# Altium schematic sheet USB3.0.SchDoc: USB
size A3
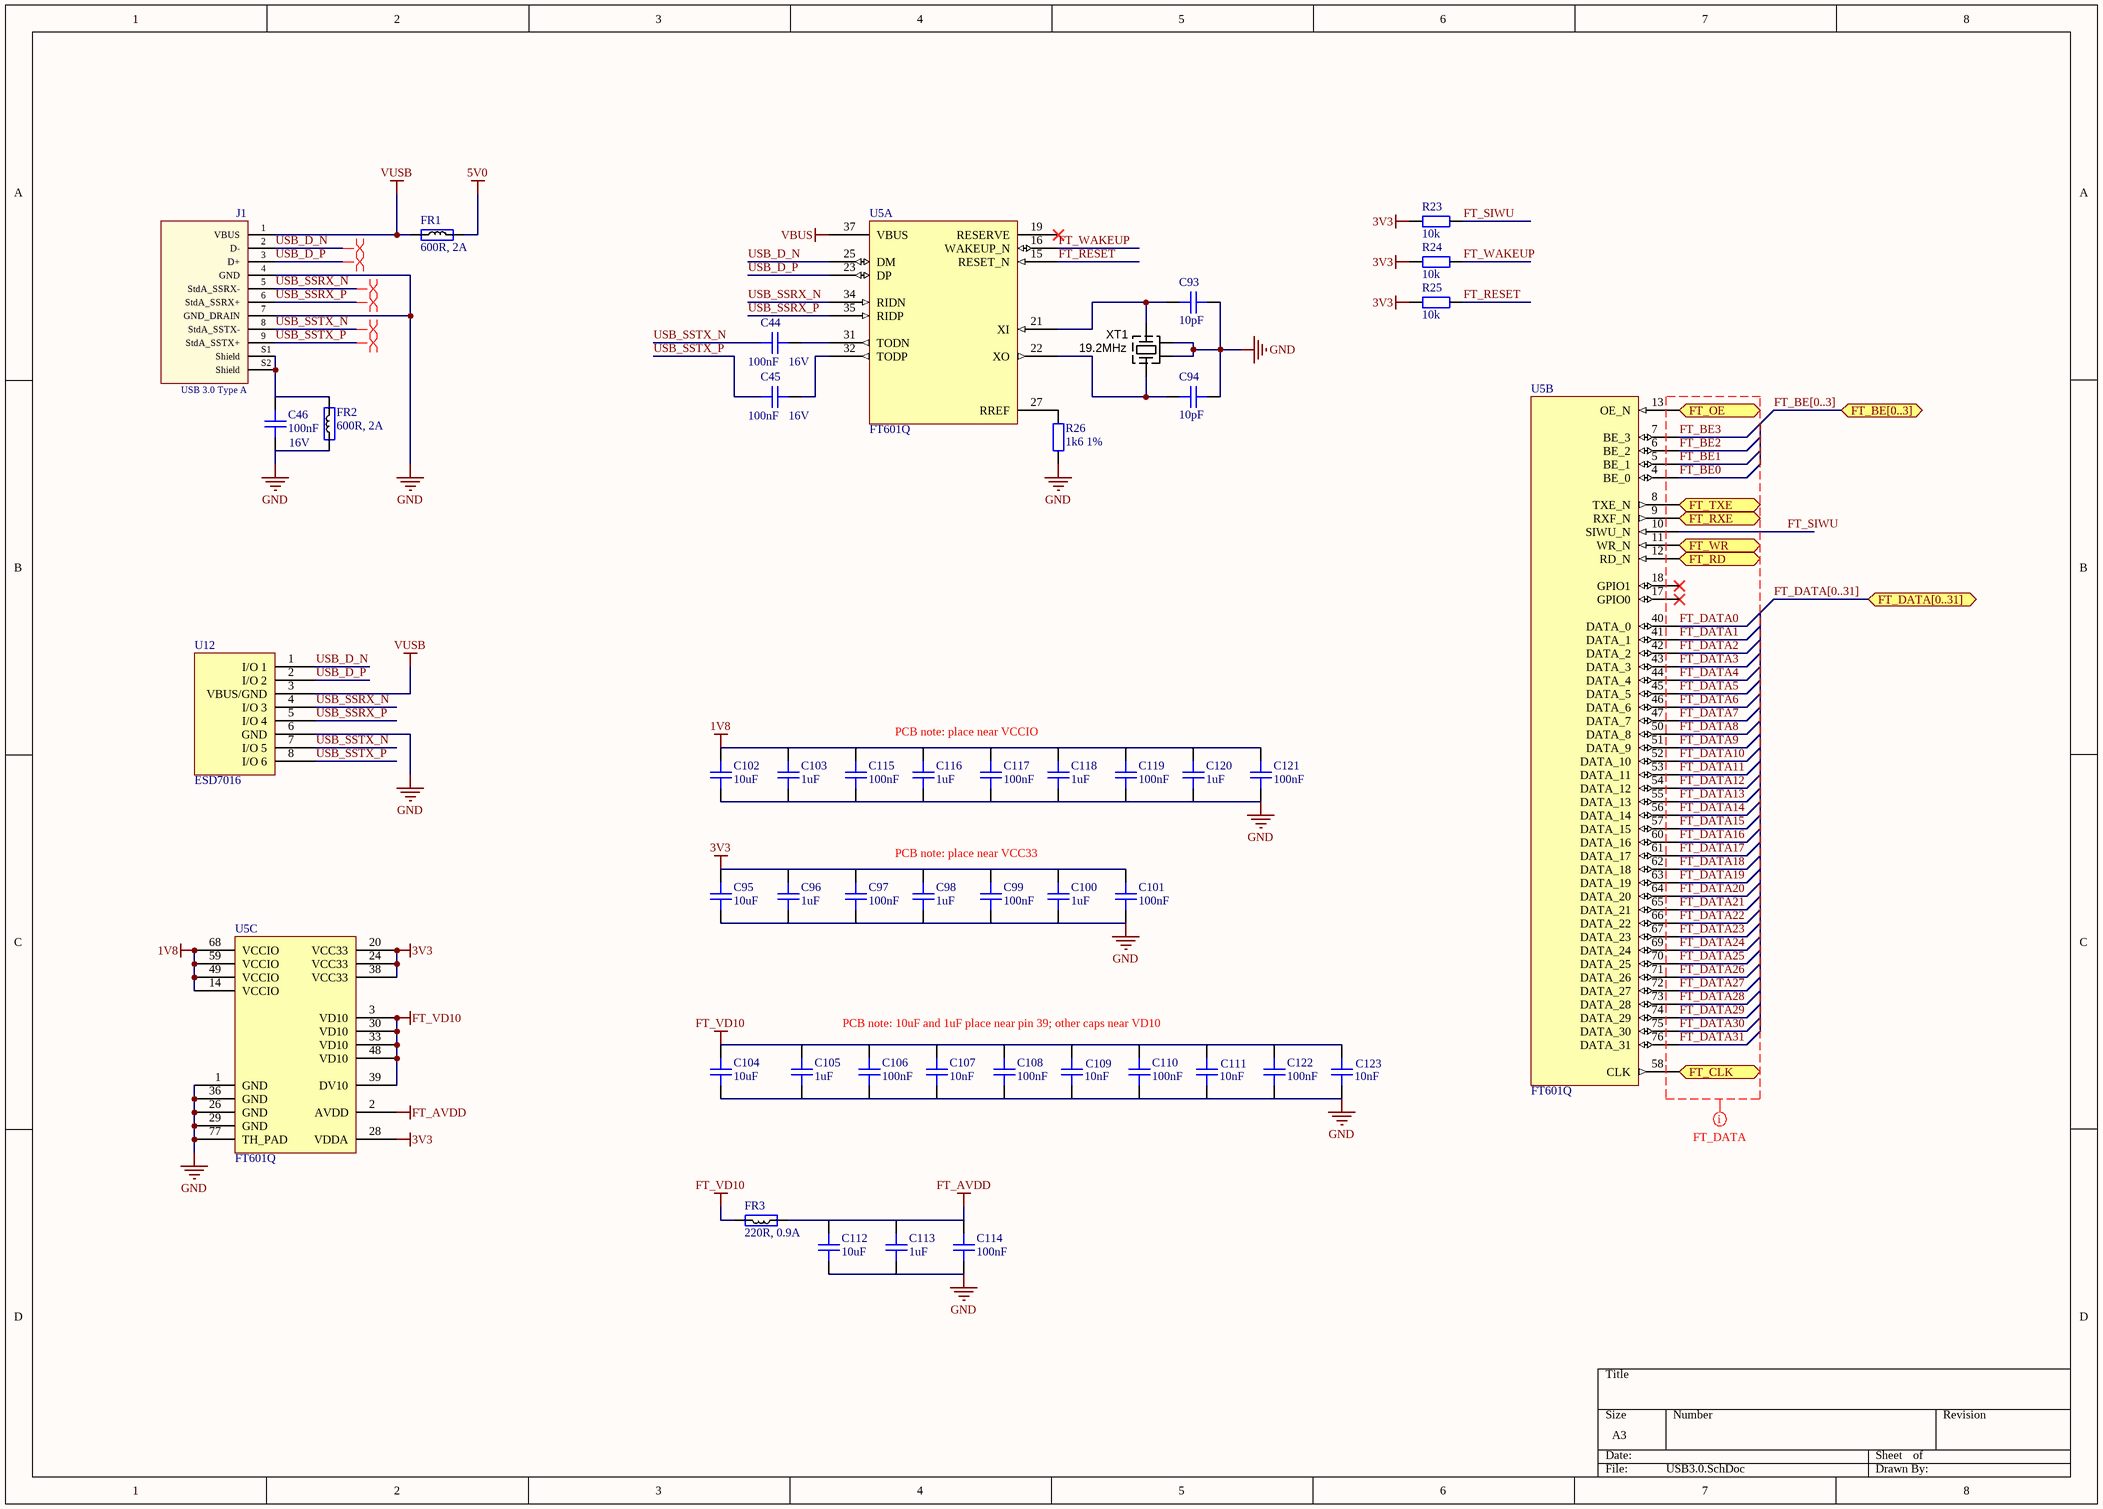
[diagram p0: USB3.0.SchDoc]

## Parts
C44  100nF  Voltage Rating: 16V  [CAP0402]
C45  100nF  Voltage Rating: 16V  [CAP0402]
C46  100nF  Voltage Rating: 16V  [CAP0402]
C93  10pF  [CAP0402]
C94  10pF  [CAP0402]
C95  10uF  [CAP0402]
C96  1uF  [CAP0402]
C97  100nF  [CAP0402]
C98  1uF  [CAP0402]
C99  100nF  [CAP0402]
C100  1uF  [CAP0402]
C101  100nF  [CAP0402]
C102  10uF  [CAP0402]
C103  1uF  [CAP0402]
C104  10uF  [CAP0402]
C105  1uF  [CAP0402]
C106  100nF  [CAP0402]
C107  10nF  [CAP0402]
C108  100nF  [CAP0402]
C109  10nF  [CAP0402]
C110  100nF  [CAP0402]
C111  10nF  [CAP0402]
C112  10uF  [CAP0402]
C113  1uF  [CAP0402]
C114  100nF  [CAP0402]
C115  100nF  [CAP0402]
C116  1uF  [CAP0402]
C117  100nF  [CAP0402]
C118  1uF  [CAP0402]
C119  100nF  [CAP0402]
C120  1uF  [CAP0402]
C121  100nF  [CAP0402]
C122  100nF  [CAP0402]
C123  10nF  [CAP0402]
FR1  600R, 2A  [RES0402]
FR2  600R, 2A  [RES0402]
FR3  220R, 0.9A  [RES0402]
J1  USB 3.0 Type A  [692122030100]
R23  10k  [RES0402]
R24  10k  [RES0402]
R25  10k  [RES0402]
R26  1k6 1%  [RES0402]
U5  FT601Q  [FT601Q]  (parts A,B,C of 3)
U12  ESD7016  [ESD7016]
XT1  19.2MHz  [CRYSTAL_4-LCC]

## Ports
FT_BE[0..3] (bidir), FT_CLK, FT_DATA[0..31] (bidir), FT_OE, FT_RD, FT_RXE, FT_TXE, FT_WR

## Nets
1V8: U5.14(VCCIO) U5.49(VCCIO) U5.59(VCCIO) U5.68(VCCIO)
3V3: U5.20(VCC33) U5.24(VCC33) U5.28(VDDA) U5.38(VCC33)
FT_AVDD: U5.2(AVDD)
FT_VD10: U5.3(VD10) U5.30(VD10) U5.33(VD10) U5.39(DV10) U5.48(VD10)
GND: J1.4(GND) J1.7(GND_DRAIN) U5.1(GND) U5.26(GND) U5.29(GND) U5.36(GND) U5.77(TH_PAD) U12.6(GND)
VBUS: U5.37(VBUS)
VUSB: J1.1(VBUS) U12.3(VBUS/GND)
FT_BE0: U5.4(BE_0)
FT_BE1: U5.5(BE_1)
FT_BE2: U5.6(BE_2)
FT_BE3: U5.7(BE_3)
FT_CLK: U5.58(CLK) ; port FT_CLK
FT_DATA0: U5.40(DATA_0)
FT_DATA1: U5.41(DATA_1)
FT_DATA2: U5.42(DATA_2)
FT_DATA3: U5.43(DATA_3)
FT_DATA4: U5.44(DATA_4)
FT_DATA5: U5.45(DATA_5)
FT_DATA6: U5.46(DATA_6)
FT_DATA7: U5.47(DATA_7)
FT_DATA8: U5.50(DATA_8)
FT_DATA9: U5.51(DATA_9)
FT_DATA10: U5.52(DATA_10)
FT_DATA11: U5.53(DATA_11)
FT_DATA12: U5.54(DATA_12)
FT_DATA13: U5.55(DATA_13)
FT_DATA14: U5.56(DATA_14)
FT_DATA15: U5.57(DATA_15)
FT_DATA16: U5.60(DATA_16)
FT_DATA17: U5.61(DATA_17)
FT_DATA18: U5.62(DATA_18)
FT_DATA19: U5.63(DATA_19)
FT_DATA20: U5.64(DATA_20)
FT_DATA21: U5.65(DATA_21)
FT_DATA22: U5.66(DATA_22)
FT_DATA23: U5.67(DATA_23)
FT_DATA24: U5.69(DATA_24)
FT_DATA25: U5.70(DATA_25)
FT_DATA26: U5.71(DATA_26)
FT_DATA27: U5.72(DATA_27)
FT_DATA28: U5.73(DATA_28)
FT_DATA29: U5.74(DATA_29)
FT_DATA30: U5.75(DATA_30)
FT_DATA31: U5.76(DATA_31)
FT_OE: U5.13(OE_N) ; port FT_OE
FT_RD: U5.12(RD_N) ; port FT_RD
FT_RESET: U5.15(RESET_N)
FT_RXE: U5.9(RXF_N) ; port FT_RXE
FT_SIWU: U5.10(SIWU_N)
FT_TXE: U5.8(TXE_N) ; port FT_TXE
FT_WAKEUP: U5.16(WAKEUP_N)
FT_WR: U5.11(WR_N) ; port FT_WR
USB_D_N: J1.2(D-) U5.25(DM) U12.1(I/O_1)
USB_D_P: J1.3(D+) U5.23(DP) U12.2(I/O_2)
USB_SSRX_N: J1.5(StdA_SSRX-) U5.34(RIDN) U12.4(I/O_3)
USB_SSRX_P: J1.6(StdA_SSRX+) U5.35(RIDP) U12.5(I/O_4)
USB_SSTX_N: C44.2 J1.8(StdA_SSTX-) U12.7(I/O_5)
USB_SSTX_P: C45.2 J1.9(StdA_SSTX+) U12.8(I/O_6)
NetJ1_S1: J1.S1(Shield) J1.S2(Shield)

Not connected (* = marked no-connect by the designer): C44 1; C45 1; C46 1 2; C93 1 2; C94 1 2; C95 1 2; C96 1 2; C97 1 2; C98 1 2; C99 1 2; C100 1 2; C101 1 2; C102 1 2; C103 1 2; C104 1 2; C105 1 2; C106 1 2; C107 1 2; C108 1 2; C109 1 2; C110 1 2; C111 1 2; C112 1 2; C113 1 2; C114 1 2; C115 1 2; C116 1 2; C117 1 2; C118 1 2; C119 1 2; C120 1 2; C121 1 2; C122 1 2; C123 1 2; FR1 1 2; FR2 1 2; FR3 1 2; R23 1 2; R24 1 2; R25 1 2; R26 1 2; U5 17(GPIO0)* 18(GPIO1)* 19(RESERVE)* 21(XI) 22(XO) 27(RREF) 31(TODN) 32(TODP); XT1 1(X) 2(GND) 3(X) 4(GND)

## Buses and harness runs
bus FT_BE[0..3] = port FT_BE[0..3]
bus FT_DATA[0..31] = port FT_DATA[0..31]

## Layout directives
net class Undefined: FT_BE0, FT_BE1, FT_BE2, FT_BE3, FT_DATA0, FT_DATA1, FT_DATA2, FT_DATA3, FT_DATA4, FT_DATA5, FT_DATA6, FT_DATA7, FT_DATA8, FT_DATA9, FT_DATA10, FT_DATA11, FT_DATA12, FT_DATA13, FT_DATA14, FT_DATA15, FT_DATA16, FT_DATA17, FT_DATA18, FT_DATA19, FT_DATA20, FT_DATA21, FT_DATA22, FT_DATA23, FT_DATA24, FT_DATA25, FT_DATA26, FT_DATA27, FT_DATA28, FT_DATA29, FT_DATA30, FT_DATA31
differential pair: USB_D_N, USB_D_P, USB_SSRX_N, USB_SSRX_P, USB_SSTX_N, USB_SSTX_P

## Notes on the sheet
- PCB note: place near VCCIO
- PCB note: place near VCC33
- PCB note: 10uF and 1uF place near pin 39; other caps near VD10
- Labels drawn without touching a wire or pin: 3V3, GND

## Library data of the parts
C44-C46 C93-C123 = Cap_0402
  C44-C46 C97 C99 C101 C106 C108 C110 C114 C115 C117 C119 C121 C122: Value: 100nF
  C93 C94: Value: 10pF
  C95 C102 C104 C112: Value: 10uF
  C96 C98 C100 C103 C105 C113 C116 C118 C120: Value: 1uF
  C107 C109 C111 C123: Value: 10nF
FR1-FR3 = Ferrite
J1 = 692122030100: USB 3.0 Type A Horizontal SMT WR-COM; Rated Current: 0.25 A; Gender: Female; ComponentLink1Description: Manufacturer; ComponentLink1URL: http://www.we-online.de; ComponentLink2Description: Datasheet; ComponentLink2URL: http://katalog.we-online.de/em/datasheet/692122030100.pdf; Part Number: 692122030100; Published Date: May 2018; Publisher: Wurth Elektronik; Orientation: Horizontal; Interface Type: USB 3.0 Type A; Operating Temperature: -20 to 85 degC; Mounting Technology: SMT; Packaging: Tape and Reel
R23-R26 = Res_0402
  R23-R25: Value: 10k
  R26: Value: 1k6 1%
U5 = FT601Q: Manufacturer: FTDI, Future Technology Devices International Ltd; Manufacturer Part Number 1: FT601Q-T; Function: Bridge, USB to FIFO; Standards: USB 3.0; Voltage - Supply: 1.65 V ~ 3.6 V; Protocol: USB; Interface: FIFO; Supplier 1: Digi-Key; Operating Temperature: -40°C ~ 85°C; Packaging: Tray; Category: Integrated Circuits (ICs); Package / Case: 76-VFQFN Exposed Pad; Supplier Device Package: 76-QFN (9x9); Current - Supply: -; RoHS: RoHS Compliant; Supplier Part Number 1: 768-1252-ND
U12 = ESD7016: Manufacturer Part Number 1: ESD7016MUTAG; Manufacturer: ON Semiconductor; Unidirectional Channels: 8; Capacitance @ Frequency: 0.15pF @ 1MHz; Power Line Protection: No; Voltage - Reverse Standoff (Typ): 5V (Max); Voltage - Breakdown (Min): 5.5V; Current - Peak Pulse (10/1000µs): 1A (8/20µs); Voltage - Clamping (Max) @ Ipp: 10V; Supplier 1: Digi-Key; Category: Circuit Protection; RoHS: RoHS Compliant; Bidirectional Channels: -; Packaging: Digi-Reel®; Type: Zener; Operating Temperature: -55°C ~ 125°C (TJ); Mounting Type: Surface Mount; Power - Peak Pulse: -; Package / Case: 8-UFSFN; Supplier Device Package: 8-UDFN (3.3x1.0); Applications: General Purpose; Supplier Part Number 1: ESD7016MUTAGOSDKR-ND
XT1 = CRYSTAL_19M2: Oscillator Crystal 27.12 MHz 10ppm; Manufacturer 1: TXC CORPORATION; Manufacturer Part Number 1: 7M-27.120MEEQ-T; Ratings: 4.9152 MHz Crystal; Load Capacitance: 10pF; Operating Mode: Fundamental; Package / Case: 2.5mm pitch; Material: Ceramic; Supplier 1: Digi-Key; Supplier Part Number 1: 887-1329-1-ND; Type: MHz Crystal; Frequency Stability: ±10ppm; Frequency Tolerance: ±10ppm; Operating Temperature: -20°C ~ 70°C; Mounting Type: Surface Mount; Size / Dimension: 0.126" L x 0.098" W (3.20mm x 2.50mm); ComponentLink1URL: http://www.txccrystal.com/images/pdf/7m-accuracy.pdf; ComponentLink1Description: http://www.txccrystal.com/images/pdf/7m-accuracy.pdf